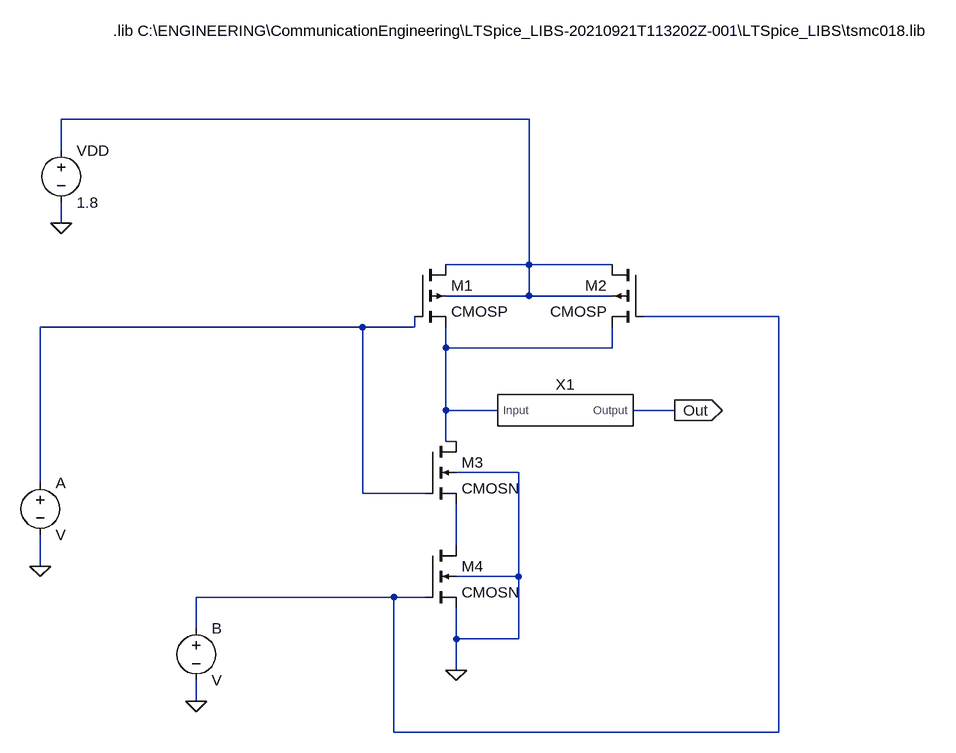
[diagram p0: schematic Draft6.asc]
Draft6.asc, the LTspice schematic file:
Version 4
SHEET 1 1644 1012
WIRE 912 64 192 64
WIRE 192 112 192 64
WIRE 192 224 192 192
WIRE 912 288 912 64
WIRE 912 288 784 288
WIRE 1040 288 912 288
WIRE 912 336 912 288
WIRE 912 336 784 336
WIRE 1040 336 912 336
WIRE 1296 368 1088 368
WIRE 656 384 160 384
WIRE 736 384 736 368
WIRE 736 384 656 384
WIRE 784 416 784 384
WIRE 1040 416 1040 384
WIRE 1040 416 784 416
WIRE 784 512 784 416
WIRE 864 512 784 512
WIRE 1136 512 1072 512
WIRE 784 560 784 512
WIRE 800 560 784 560
WIRE 896 608 800 608
WIRE 160 624 160 384
WIRE 656 640 656 384
WIRE 752 640 656 640
WIRE 800 720 800 656
WIRE 160 752 160 704
WIRE 896 768 896 608
WIRE 896 768 800 768
WIRE 704 800 400 800
WIRE 752 800 704 800
WIRE 400 848 400 800
WIRE 800 864 800 816
WIRE 896 864 896 768
WIRE 896 864 800 864
WIRE 800 912 800 864
WIRE 400 960 400 928
WIRE 704 1008 704 800
WIRE 1296 1008 1296 368
WIRE 1296 1008 704 1008
FLAG 192 224 0
FLAG 160 752 0
FLAG 400 960 0
FLAG 800 912 0
FLAG 1136 512 Out
IOPIN 1136 512 Out
SYMBOL pmos4 736 288 R0
SYMATTR InstName M1
SYMATTR Value CMOSP
SYMATTR Value2 l=180n w=220n
SYMBOL pmos4 1088 288 M0
SYMATTR InstName M2
SYMATTR Value CMOSP
SYMATTR Value2 l=180n w=220n
SYMBOL nmos4 752 560 R0
SYMATTR InstName M3
SYMATTR Value CMOSN
SYMATTR Value2 l=180n w=220n
SYMBOL nmos4 752 720 R0
SYMATTR InstName M4
SYMATTR Value CMOSN
SYMATTR Value2 l=180n w=220n
SYMBOL voltage 192 96 R0
SYMATTR InstName VDD
SYMATTR Value 1.8
SYMBOL voltage 160 608 R0
SYMATTR InstName A
SYMBOL voltage 400 832 R0
SYMATTR InstName B
SYMBOL NOT_model1 960 512 R0
SYMATTR InstName X1
TEXT 272 -72 Left 2 !.lib C:\\ENGINEERING\\CommunicationEngineering\\LTSpice_LIBS-20210921T113202Z-001\\LTSpice_LIBS\\tsmc018.lib

The netlist it stands for:
* Draft6.asc
M1 N001 N003 N004 N001 CMOSP l=180n w=220n
M2 N001 N002 N004 N001 CMOSP l=180n w=220n
M3 N004 N003 N005 0 CMOSN l=180n w=220n
M4 N005 N002 0 0 CMOSN l=180n w=220n
VDD N001 0 1.8
V§A N003 0 V
V§B N002 0 V
XX1 N004 Out NOT0  ; pins Input Output
.model NMOS NMOS
.model PMOS PMOS
.lib standard.mos
.lib C:\ENGINEERING\CommunicationEngineering\LTSpice_LIBS-20210921T113202Z-001\LTSpice_LIBS\tsmc018.lib
.backanno
.end